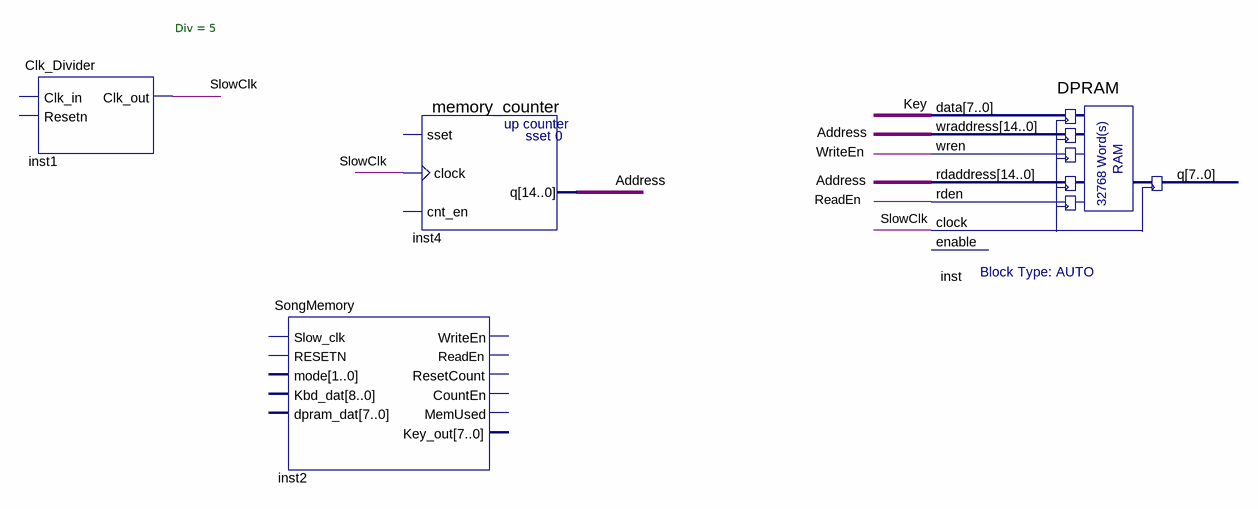
[diagram p0: schematic sheet]
// Quartus schematic Recorder.bdf as structural Verilog: 4 symbols, 0 pins
module Recorder (
);

  wire Address, Key, ReadEn, SlowClk, WriteEn;

  Clk_Divider #(.Div(5)) inst1 (.Clk_out(SlowClk));  // open: Clk_in, Resetn
  SongMemory inst2 ();  // open: Slow_clk, RESETN, mode, Kbd_dat, dpram_dat, WriteEn, ReadEn, ResetCount, CountEn, MemUsed, Key_out
  memory_counter inst4 (.clock(SlowClk), .q(Address));  // open: sset, cnt_en
  DPRAM inst (
    .data({8{Key}}), .wraddress({15{Address}}), .wren(WriteEn), .rdaddress({15{Address}}), .rden(ReadEn),
    .clock(SlowClk));  // open: enable, q
endmodule
